# EAGLE design tiny2313dev (EAGLE 5.07)
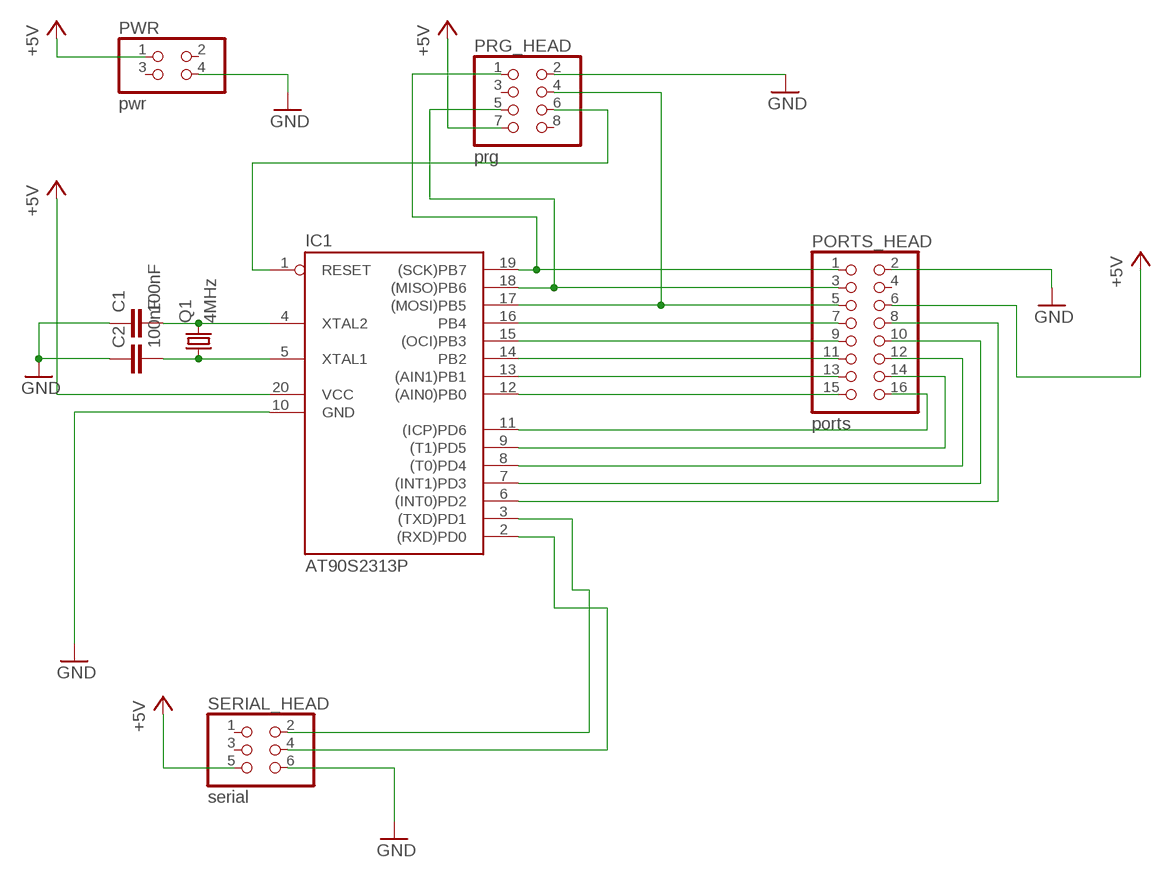
[diagram p0: schematic, sheet 1]

## Parts
C1  100nF  C-EU050-024X044  [C050-024X044]
C2  100nF  C-EU050-024X044  [C050-024X044]
IC1  AT90S2313P  [DIL20]
PORTS_HEAD  ports  PINHD-2X8  [2X08]
PRG_HEAD  prg  PINHD-2X4  [2X04]
PWR  pwr  PINHD-2X2  [2X02]
Q1  4MHz  CRYSTALHC33U-V  [HC33U-V]
SERIAL_HEAD  serial  PINHD-2X3  [2X03]

## Nets
+5V: IC1.20(VCC) PORTS_HEAD.6 PRG_HEAD.7 PWR.1 SERIAL_HEAD.5
GND: C1.1 C2.1 IC1.10(GND) PORTS_HEAD.2 PRG_HEAD.2 PWR.4 SERIAL_HEAD.6
N$1: IC1.16(PB4) PORTS_HEAD.7
N$2: IC1.15((OCI)PB3) PORTS_HEAD.9
N$3: IC1.14(PB2) PORTS_HEAD.11
N$4: IC1.13((AIN1)PB1) PORTS_HEAD.13
N$5: IC1.12((AIN0)PB0) PORTS_HEAD.15
N$6: IC1.3((TXD)PD1) SERIAL_HEAD.2
N$7: IC1.2((RXD)PD0) SERIAL_HEAD.4
N$8: IC1.11((ICP)PD6) PORTS_HEAD.16
N$9: IC1.9((T1)PD5) PORTS_HEAD.14
N$10: IC1.8((T0)PD4) PORTS_HEAD.12
N$11: IC1.7((INT1)PD3) PORTS_HEAD.10
N$12: IC1.6((INT0)PD2) PORTS_HEAD.8
N$13: IC1.17((MOSI)PB5) PORTS_HEAD.5 PRG_HEAD.4
N$15: IC1.19((SCK)PB7) PORTS_HEAD.1 PRG_HEAD.1
N$16: C1.2 IC1.4(XTAL2) Q1.2
N$17: IC1.1(RESET) PRG_HEAD.6
N$18: C2.2 IC1.5(XTAL1) Q1.1
N$20: IC1.18((MISO)PB6) PORTS_HEAD.3 PRG_HEAD.5
Unconnected: PORTS_HEAD.4 PRG_HEAD.3 PRG_HEAD.8 PWR.2 PWR.3 SERIAL_HEAD.1 SERIAL_HEAD.3

## Library data of the parts
C1 C2 = rcl:C-EU: CAPACITOR, European symbol
IC1 = atmel:AT90S2313: MICROCONTROLLER 2 Kbytes FLASH 128 bytes SRAM 128 bytes EEPROM UART
PORTS_HEAD = pinhead:PINHD-2X8: PIN HEADER
PRG_HEAD = pinhead:PINHD-2X4: PIN HEADER
PWR = pinhead:PINHD-2X2: PIN HEADER
Q1 = crystal:CRYSTAL: CRYSTAL
SERIAL_HEAD = pinhead:PINHD-2X3: PIN HEADER

## Board
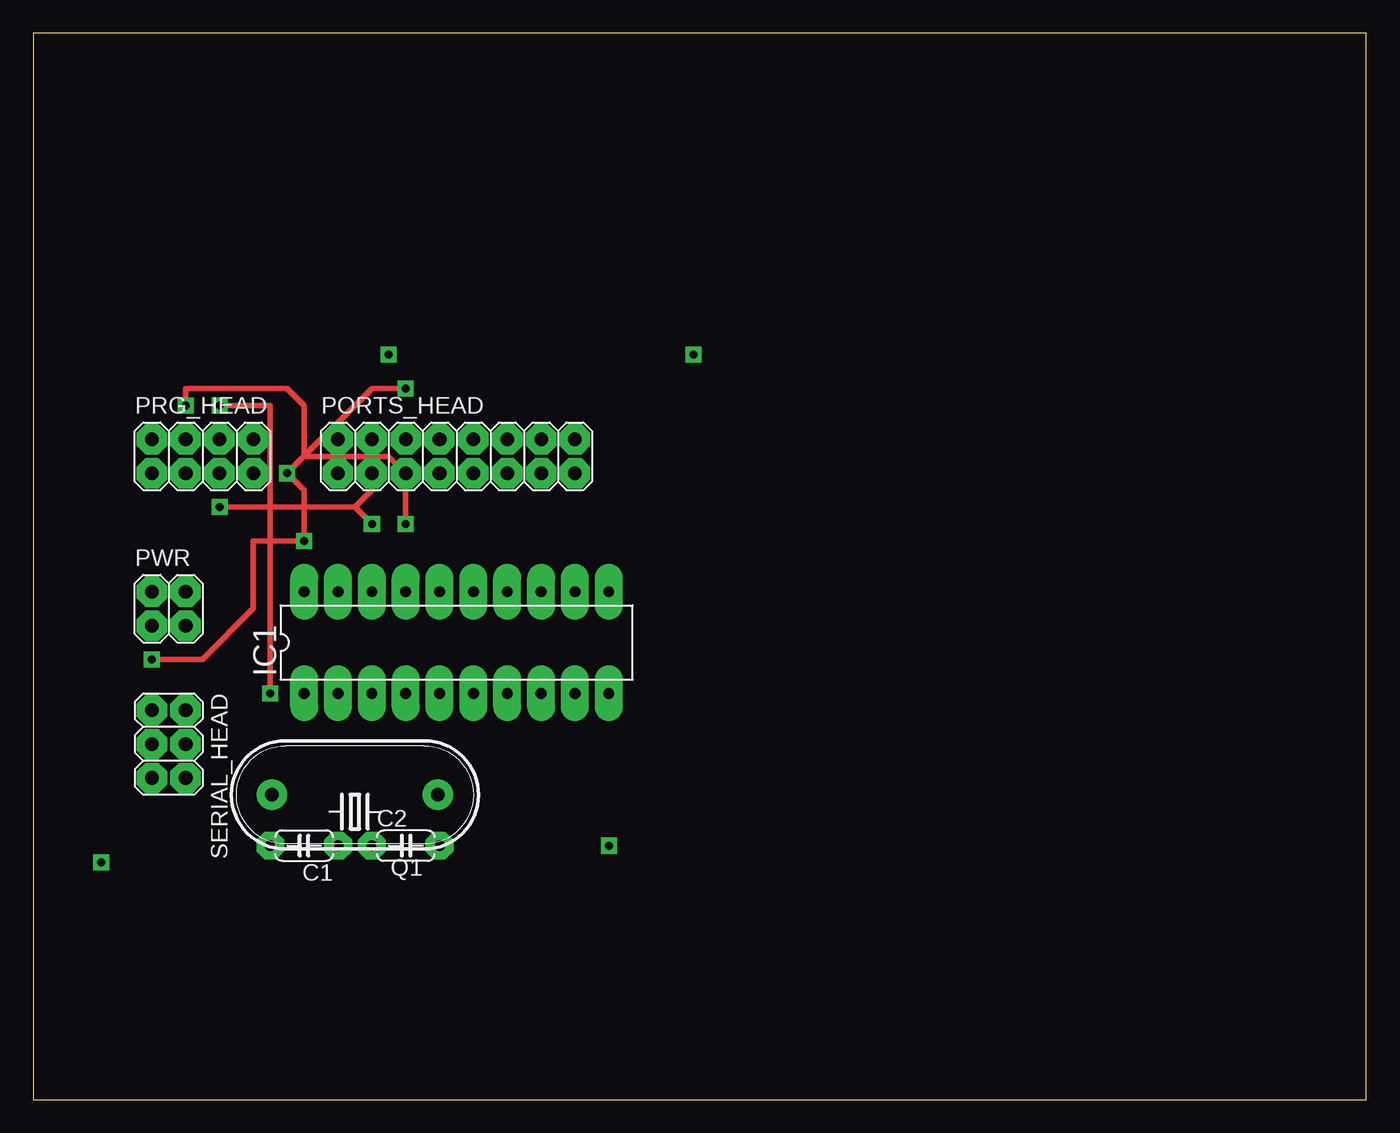
[diagram p1: board, top side]
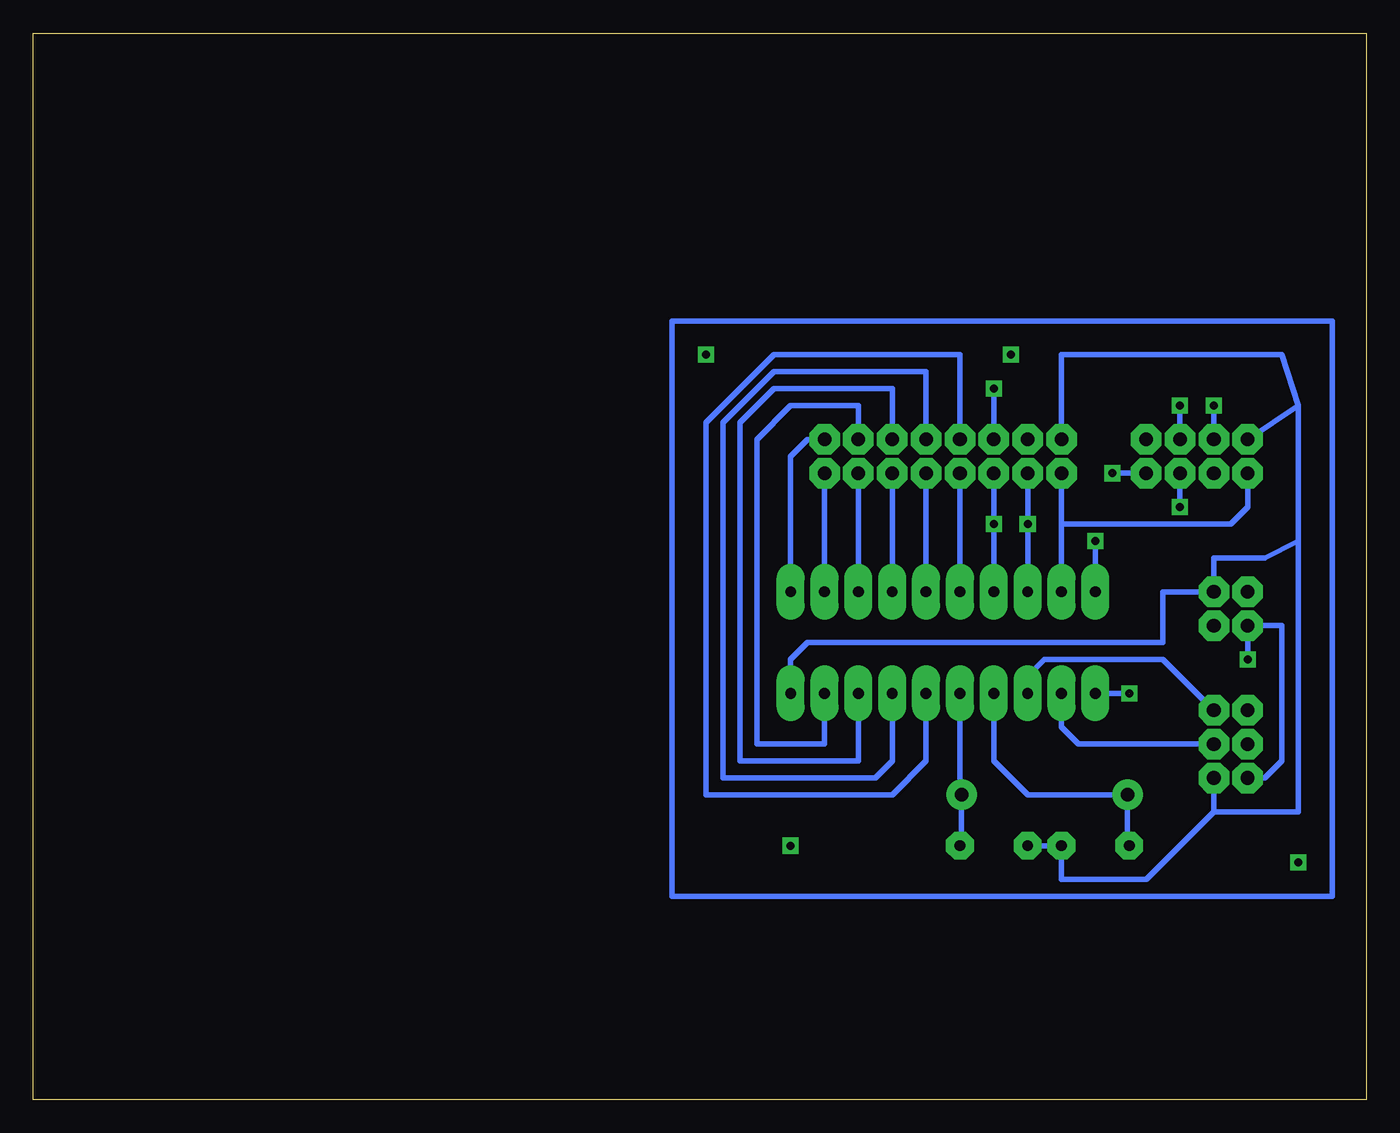
[diagram p2: board, bottom side, seen from below]

Size 100 x 80 mm. Coordinates in mm from the lower left corner, seen from the top.
Outline: 0,0 100,0 100,80 0,80 0,0
Copper layers (1*16): Top 0.035mm / dielectric 1.5mm / Bottom 0.035mm
Design rules "default": minimum track width 10mil, minimum drill 32mil, track to track 12mil, track to pad 12mil, pad to pad 12mil, via to via 12mil, smd to smd 8mil, copper to edge 40mil, drill to drill 40mil, minimum pad ring 25mil, minimum via ring 12mil, stop-mask expansion 4mil, vias tented up to drill 0mil, thermal gap 10mil

### Footprints (pad centres in the part's own frame; a part is rotated, then mirrored left to right if it is on the bottom)
C050-024X044 = drill 0.813 octagon: 1 -2.54,0; 2 2.54,0
DIL20 = drill 0.813 long: 1 -11.43,-3.81; 2 -8.89,-3.81; 3 -6.35,-3.81; 4 -3.81,-3.81; 5 -1.27,-3.81; 6 1.27,-3.81; 7 3.81,-3.81; 8 6.35,-3.81; 9 8.89,-3.81; 10 11.43,-3.81; 11 11.43,3.81; 12 8.89,3.81; 13 6.35,3.81; 14 3.81,3.81; 15 1.27,3.81; 16 -1.27,3.81; 17 -3.81,3.81; 18 -6.35,3.81; 19 -8.89,3.81; 20 -11.43,3.81
2X08 = drill 1.016 octagon: 1 -8.89,-1.27; 2 -8.89,1.27; 3 -6.35,-1.27; 4 -6.35,1.27; 5 -3.81,-1.27; 6 -3.81,1.27; 7 -1.27,-1.27; 8 -1.27,1.27; 9 1.27,-1.27; 10 1.27,1.27; 11 3.81,-1.27; 12 3.81,1.27; 13 6.35,-1.27; 14 6.35,1.27; 15 8.89,-1.27; 16 8.89,1.27
2X04 = drill 1.016 octagon: 1 -3.81,-1.27; 2 -3.81,1.27; 3 -1.27,-1.27; 4 -1.27,1.27; 5 1.27,-1.27; 6 1.27,1.27; 7 3.81,-1.27; 8 3.81,1.27
2X02 = drill 1.016 octagon: 1 -1.27,-1.27; 2 -1.27,1.27; 3 1.27,-1.27; 4 1.27,1.27
HC33U-V = drill 1.016 round: 1 -6.223,0; 2 6.223,0
2X03 = drill 1.016 octagon: 1 -2.54,-1.27; 2 -2.54,1.27; 3 0,-1.27; 4 0,1.27; 5 2.54,-1.27; 6 2.54,1.27

### Placement (x,y rotation side)
C1  20.32,19.05 180 top
C2  27.94,19.05 0 top
IC1  31.75,34.29 0 top
PORTS_HEAD  31.75,48.26 0 top
PRG_HEAD  12.7,48.26 0 top
PWR  10.16,36.83 0 top
Q1  24.13,22.86 180 top
SERIAL_HEAD  10.16,26.67 270 top

### Tracks (layer width: path | path; a pad name or v marks a point on that pad's centre or on a via)
+5V  (via drill 0.6)  (1 unrouted)
  Top 0.406: v27.94,53.34 25.4,53.34 19.05,46.99 20.32,45.72 v20.32,41.91 16.51,41.91 16.51,36.83 12.7,33.02 v8.89,33.02
  Bottom 0.406: SERIAL_HEAD.5 7.62,24.13 6.35,25.4 6.35,35.56 PWR.1 v8.89,33.02 | PRG_HEAD.7 19.05,46.99 | v20.32,41.91 IC1.20 | v27.94,53.34 PORTS_HEAD.6
GND
  Bottom 0.406: C2.1 C1.1 22.86,16.51 16.51,16.51 11.43,21.59 | PORTS_HEAD.2 22.86,55.88 6.35,55.88 5.08,52.07 | 5.08,52.07 PRG_HEAD.2 | 5.08,41.91 7.62,40.64 11.43,40.64 PWR.4 15.24,38.1 15.24,34.29 41.91,34.29 43.18,33.02 IC1.10 | 5.08,41.91 5.08,52.07 | 11.43,21.59 SERIAL_HEAD.6 | 11.43,21.59 5.08,21.59 5.08,41.91
N$1
  Bottom 0.406: IC1.16 PORTS_HEAD.7
N$2
  Bottom 0.406: IC1.15 PORTS_HEAD.9
N$3
  Bottom 0.406: IC1.14 PORTS_HEAD.11
N$4
  Bottom 0.406: IC1.13 PORTS_HEAD.13
N$5
  Bottom 0.406: IC1.12 PORTS_HEAD.15
N$6
  Bottom 0.406: IC1.3 25.4,31.75 24.13,33.02 15.24,33.02 SERIAL_HEAD.2
N$7
  Bottom 0.406: SERIAL_HEAD.4 21.59,26.67 22.86,27.94 IC1.2
N$8
  Bottom 0.406: IC1.11 43.18,48.26 41.91,49.53 PORTS_HEAD.16
N$9
  Bottom 0.406: IC1.9 40.64,26.67 45.72,26.67 45.72,49.53 43.18,52.07 38.1,52.07 PORTS_HEAD.14
N$10
  Bottom 0.406: IC1.8 38.1,25.4 46.99,25.4 46.99,50.8 44.45,53.34 35.56,53.34 PORTS_HEAD.12
N$11
  Bottom 0.406: IC1.7 35.56,25.4 36.83,24.13 48.26,24.13 48.26,50.8 44.45,54.61 33.02,54.61 PORTS_HEAD.10
N$12
  Bottom 0.406: IC1.6 33.02,25.4 35.56,22.86 49.53,22.86 49.53,50.8 44.45,55.88 30.48,55.88 PORTS_HEAD.8
N$13  (via drill 0.6)  (1 unrouted)
  Top 0.406: v27.94,43.18 PORTS_HEAD.5 26.67,48.26 20.32,48.26 20.32,52.07 19.05,53.34 11.43,53.34 11.43,52.07
  Bottom 0.406: IC1.17 v27.94,43.18 PORTS_HEAD.5 | PRG_HEAD.4 11.43,52.07
N$14  (via drill 0.6)
  other vias: 19.05,46.99
N$15
  Bottom 0.406: 22.86,43.18 IC1.19 | 22.86,43.18 PORTS_HEAD.1 | PRG_HEAD.1 8.89,44.45 10.16,43.18 22.86,43.18
N$16
  Bottom 0.406: IC1.4 27.94,25.4 25.4,22.86 Q1.2 17.91,19.18 C1.2
N$17  (via drill 0.6)  (1 unrouted)
  Top 0.406: v13.97,52.07 17.78,52.07 17.78,30.48
  Bottom 0.406: 17.78,30.48 IC1.1 | v13.97,52.07 PRG_HEAD.6
N$18
  Bottom 0.406: IC1.5 30.48,22.99 Q1.1 30.35,19.18 C2.2
N$19  (via drill 0.6)
  other vias: 25.4,43.18
N$20  (via drill 0.6)
  Top 0.406: 24.13,44.45 25.4,43.18 | v13.97,44.45 24.13,44.45 | 24.13,44.45 25.4,45.72 PORTS_HEAD.3
  Bottom 0.406: PORTS_HEAD.3 IC1.18 | v13.97,44.45 PRG_HEAD.5
N$21  (via drill 0.6)
  other vias: 11.43,52.07
N$22  (via drill 0.6)
  other vias: 13.97,52.07
N$23  (via drill 0.6)
  other vias: 13.97,44.45
N$24  (via drill 0.6)
  other vias: 17.78,30.48
N$25  (via drill 0.6)
  other vias: 20.32,41.91
N$26  (via drill 0.6)
  other vias: 27.94,53.34
N$27  (via drill 0.6)
  other vias: 8.89,33.02
N$28
  Bottom 0.406: 52.07,58.42 52.07,15.24 2.54,15.24 2.54,58.42 52.07,58.42
N$29  (via drill 0.6)
  other vias: 5.08,17.78
N$30  (via drill 0.6)
  other vias: 49.53,55.88
N$31  (via drill 0.6)
  other vias: 43.18,19.05
N$32  (via drill 0.6)
  other vias: 26.67,55.88